# EAGLE design adon3AA (EAGLE 6.5.0)
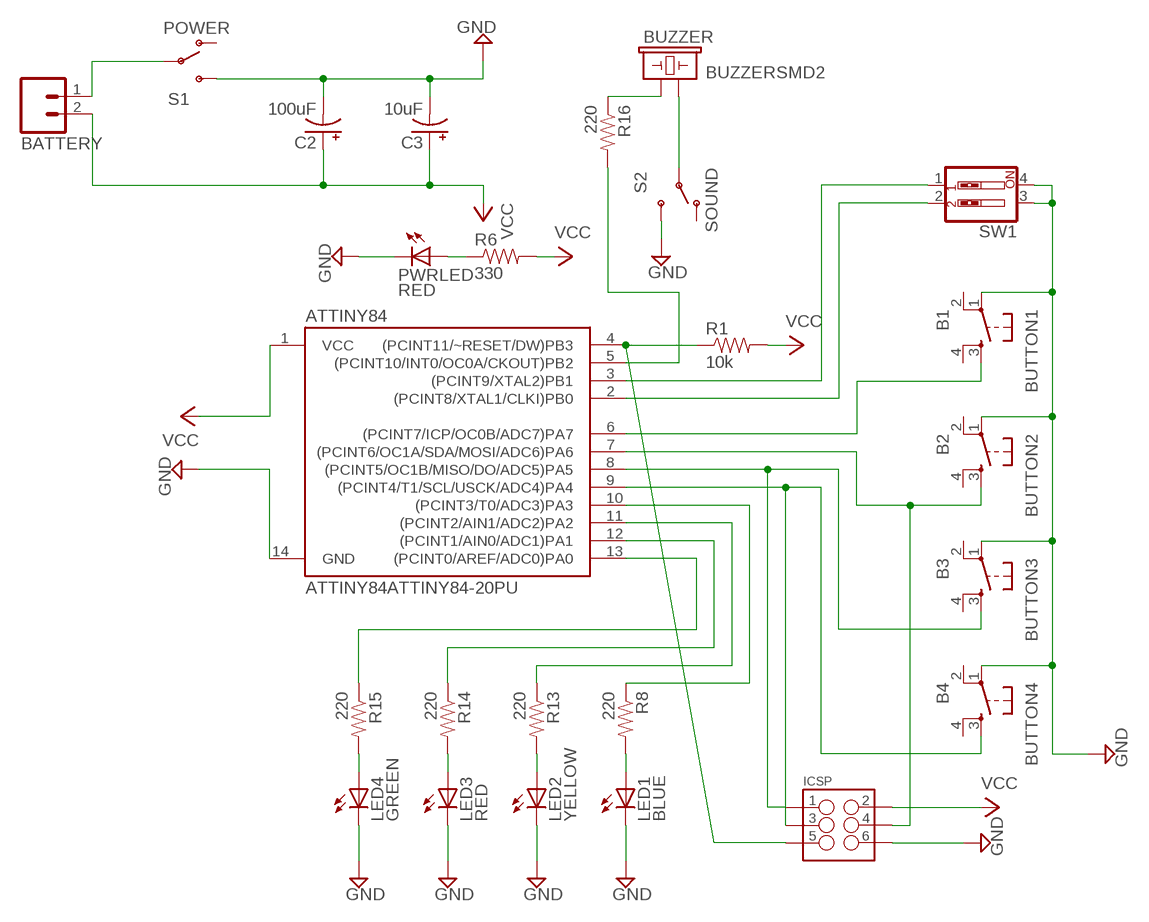
[diagram p0: schematic, sheet 1]

## Parts
ATTINY84  ATTINY84ATTINY84-20PU  [DIL14]
BATTERY  M02JST-PTH-2  [JST-2-PTH]
BUTTON1  B1  TAC_SWITCHPTH  [TACTILE-PTH]
BUTTON2  B2  TAC_SWITCHPTH  [TACTILE-PTH]
BUTTON3  B3  TAC_SWITCHPTH  [TACTILE-PTH]
BUTTON4  B4  TAC_SWITCHPTH  [TACTILE-PTH]
BUZZER  BUZZERSMD2  [BUZZER-CCV]
C2  100uF  CAP_POLPTH1  [CPOL-RADIAL-100UF-25V]
C3  10uF  CAP_POLPTH2  [CPOL-RADIAL-10UF-25V]
ICSP  M03X2NO_SILK  [2X3-NS]
LED1  BLUE  LED5MM  [LED5MM]
LED2  YELLOW  LED5MM  [LED5MM]
LED3  RED  LED5MM  [LED5MM]
LED4  GREEN  LED5MM  [LED5MM]
PWRLED  RED  LED3MM  [LED3MM]
R1  10k  RESISTORPTH-1/4W  [AXIAL-0.4]
R6  330  RESISTORPTH-1/4W  [AXIAL-0.4]
R8  220  RESISTORPTH-1/4W  [AXIAL-0.4]
R13  220  RESISTORPTH-1/4W  [AXIAL-0.4]
R14  220  RESISTORPTH-1/4W  [AXIAL-0.4]
R15  220  RESISTORPTH-1/4W  [AXIAL-0.4]
R16  220  RESISTORPTH-1/4W  [AXIAL-0.4]
S1  POWER  SWITCH-SPDTPTH_LOCK  [SWITCH-SPDT_LOCK.007S]
S2  SOUND  SWITCH-SPDTPTH_LOCK  [SWITCH-SPDT_LOCK.007S]
SW1  SW_DIP-2  [EDG-02]

## Nets
GND: ATTINY84.14(GND) BUTTON1.1 BUTTON2.1 BUTTON3.1 BUTTON4.1 C2.2(-) C3.2(-) ICSP.6 LED1.K(C) LED2.K(C) LED3.K(C) LED4.K(C) PWRLED.K(C) S1.3(S) S2.3(S) SW1.3 SW1.4
N$1: BUZZER.+ R16.P$1
N$2: PWRLED.A R6.P$1
N$3: LED1.A R8.P$2
N$4: LED2.A R13.P$2
N$5: ATTINY84.6((PCINT7/ICP/OC0B/ADC7)PA7) BUTTON1.3
N$6: ATTINY84.5((PCINT10/INT0/OC0A/CKOUT)PB2) R16.P$2
N$7: LED3.A R14.P$2
N$8: LED4.A R15.P$2
N$9: ATTINY84.7((PCINT6/OC1A/SDA/MOSI/ADC6)PA6) BUTTON2.3 ICSP.4
N$10: ATTINY84.3((PCINT9/XTAL2)PB1) SW1.1
N$11: ATTINY84.2((PCINT8/XTAL1/CLKI)PB0) SW1.2
N$12: BATTERY.1 S1.2(P)
N$13: ATTINY84.8((PCINT5/OC1B/MISO/DO/ADC5)PA5) BUTTON3.3 ICSP.1
N$14: ATTINY84.9((PCINT4/T1/SCL/USCK/ADC4)PA4) BUTTON4.3 ICSP.3
N$15: ATTINY84.10((PCINT3/T0/ADC3)PA3) R8.P$1
N$16: ATTINY84.11((PCINT2/AIN1/ADC2)PA2) R13.P$1
N$17: ATTINY84.12((PCINT1/AIN0/ADC1)PA1) R14.P$1
N$18: ATTINY84.13((PCINT0/AREF/ADC0)PA0) R15.P$1
N$21: ATTINY84.4((PCINT11/~RESET/DW)PB3) ICSP.5 R1.P$1
N$23: BUZZER.- S2.2(P)
VCC: ATTINY84.1(VCC) BATTERY.2 C2.1(+) C3.1(+) ICSP.2 R1.P$2 R6.P$2
Unconnected: BUTTON1.2 BUTTON1.4 BUTTON2.2 BUTTON2.4 BUTTON3.2 BUTTON3.4 BUTTON4.2 BUTTON4.4 S1.1(O) S2.1(O)

## Library data of the parts
ATTINY84 = SparkFun-DigitalIC:ATTINY84: Atmel 14-pin 2/4/8kB flash uC
BATTERY = SparkFun-Connectors:M02: Standard 2-pin 0.1" header. Use with - straight break away headers ( PRT-00116) - right angle break away headers (PRT-00553) - swiss pins (PRT-00743) - machine pins (PRT-00117) - female headers (PRT-00115) Molex polarized connector foot print use with: PRT-08233 with associated crimp pins and housings. 2.54_SCREWTERM for use with PRT-10571. 3.5mm Screw Terminal footprints for PRT-08084 5mm Screw Terminal footprints for use with PRT-08433; SKU: PRT-09914
BUTTON1-BUTTON4 = SparkFun-Electromechanical:TAC_SWITCH: Momentary Switch Button commonly used for reset or general input. Spark Fun Electronics SKU : COM-00097 SMT- SWCH-08247
BUZZER = SparkFun-Electromechanical:BUZZER: Buzzer 12mm Spark Fun Electronics SKU : Comp-Buzzer
C2 C3 = SparkFun-Capacitors:CAP_POL: Capacitor Polarized These are standard SMD and PTH capacitors. Normally 10uF, 47uF, and 100uF in electrolytic and tantalum varieties. Always verify the external diameter of the through hole cap, it varies with capacity, voltage, and manufacturer. The EIA devices should be standard.
ICSP = SparkFun-Connectors:M03X2: 2x3 .1" header. Shrouded, with keying- CONN-10681 SMT- CONN-11415 Pogo pins- HW-11044
LED1-LED4 PWRLED = SparkFun-LED:LED: LEDs Standard schematic elements and footprints for 5mm, 3mm, 1206, and 0603 sized LEDs. 5mm - Spark Fun Electronics SKU : COM-00529 (and others)
R1 R6 R8 R13-R16 = SparkFun-Resistors:RESISTOR: Resistor Basic schematic elements and footprints for 0603, 1206, and PTH resistors.
S1 S2 = SparkFun-Electromechanical:SWITCH-SPDT: SPDT Switch Simple slide switch, Spark Fun Electronics SKU : COM-00102 DPDT SMT slide switch, AYZ0202, SWCH-08179
SW1 = special:SW_DIP-2: DIP SWITCH

## Board
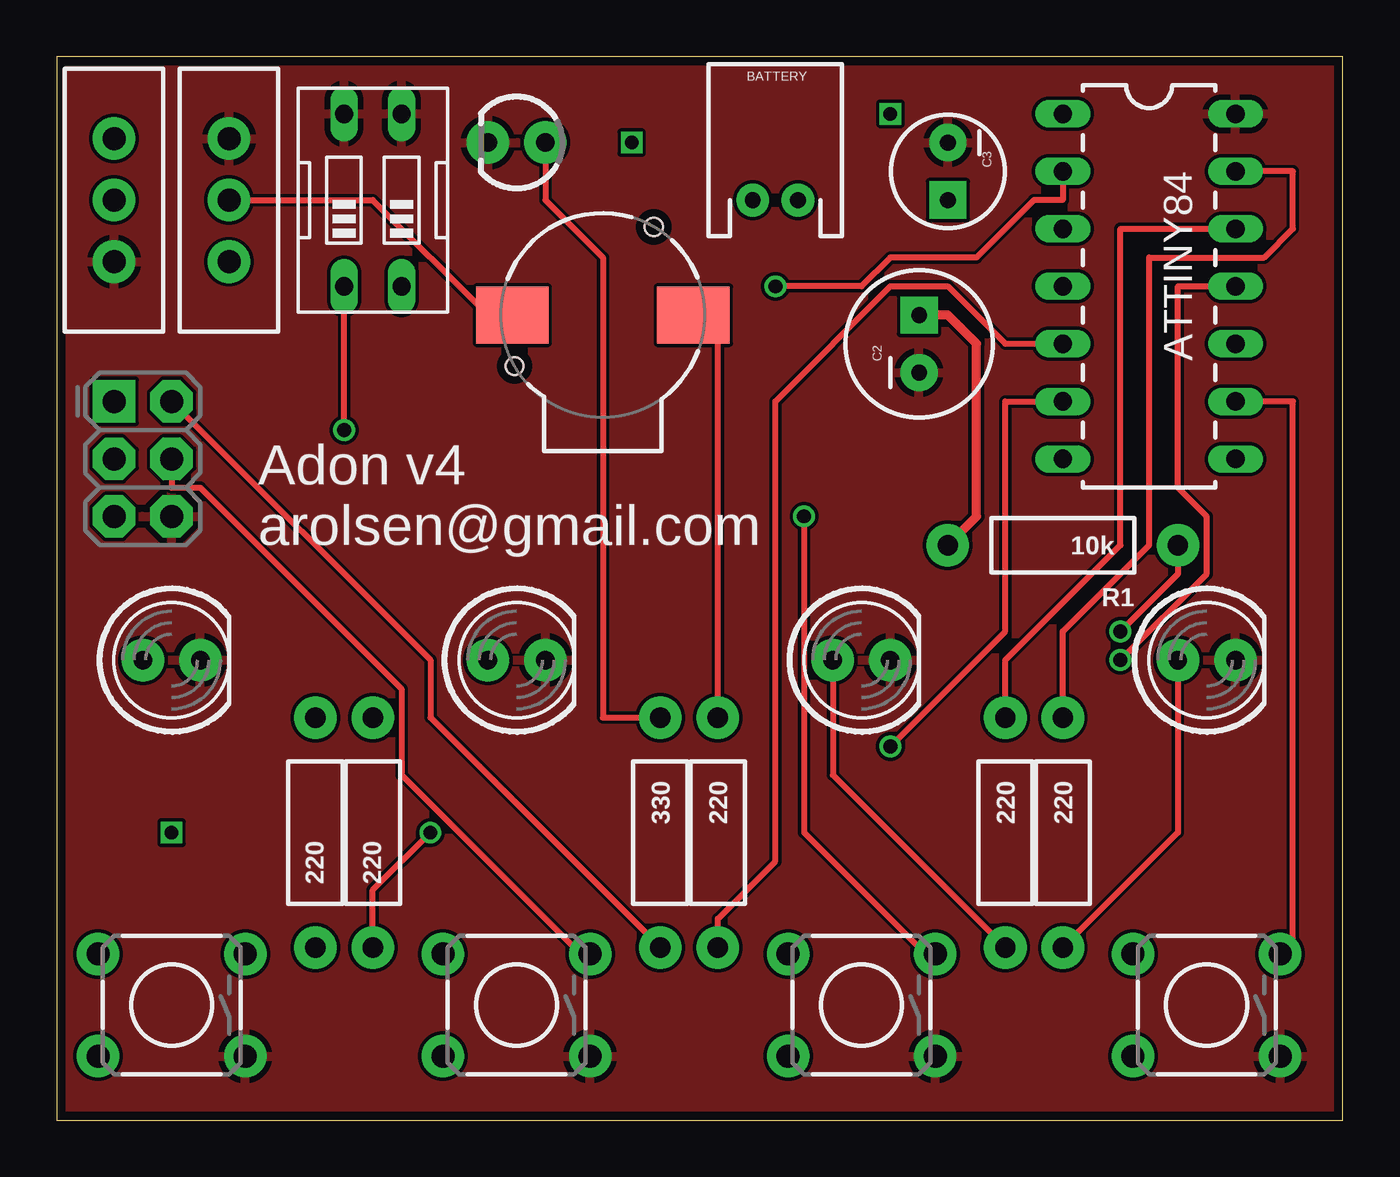
[diagram p1: board, top side]
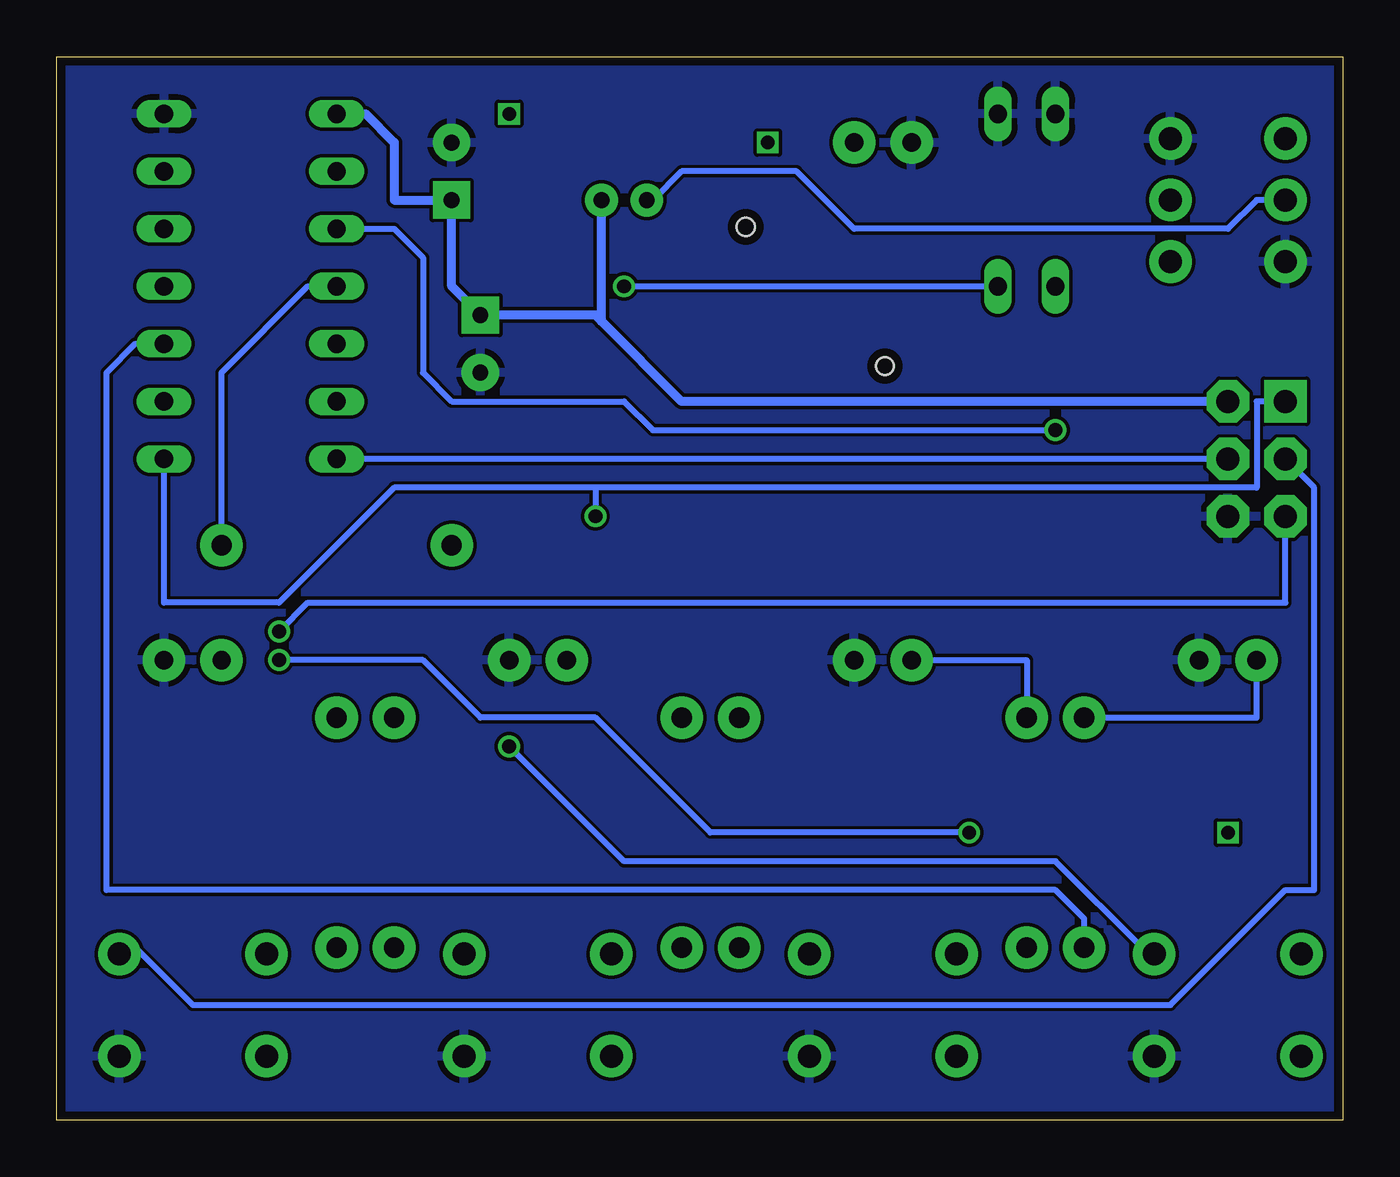
[diagram p2: board, bottom side, seen from below]

Size 56.82 x 46.98 mm. Coordinates in mm from the lower left corner, seen from the top.
Outline: 0,0 56.82,0 56.82,46.98 0,46.98 0,0
Copper layers (1*16): Top 0.0356mm / dielectric 1.5011mm / Bottom 0.0356mm
Design rules "LaenPCBOrder": minimum track width 6mil, minimum drill 13mil, track to track 6mil, track to pad 6mil, pad to pad 6mil, via to via 6mil, smd to smd 6mil, copper to edge 15mil, drill to drill 6mil, minimum pad ring 7mil, minimum via ring 7mil, stop-mask expansion 3mil, vias tented up to drill 0mil, thermal gap 10mil

### Footprints (pad centres in the part's own frame; a part is rotated, then mirrored left to right if it is on the bottom)
DIL14 = drill 0.813 long: 1 -8.89,-3.81; 2 -6.35,-3.81; 3 -3.81,-3.81; 4 -1.27,-3.81; 5 1.27,-3.81; 6 3.81,-3.81; 7 6.35,-3.81; 8 6.35,3.81; 9 3.81,3.81; 10 1.27,3.81; 11 -1.27,3.81; 12 -3.81,3.81; 13 -6.35,3.81; 14 -8.89,3.81
JST-2-PTH = drill 0.7 pad 1.448: 1 -1,0; 2 1,0
TACTILE-PTH = drill 1.016 pad 1.88: 1 -3.251,2.261; 2 3.251,2.261; 3 -3.251,-2.261; 4 3.251,-2.261
BUZZER-CCV = smd 3.2 x 2.5: + 4,0; - -4,0 | hole 0.8: -3.9,-2.25; 2.25,3.9
CPOL-RADIAL-100UF-25V = drill 0.7 pad 1.651 square: 1 1.27,0 | drill 0.7 pad 1.651: 2 -1.27,0
CPOL-RADIAL-10UF-25V = drill 0.7 pad 1.651 square: 1 1.27,0 | drill 0.7 pad 1.651: 2 -1.27,0
2X3-NS = drill 1.016 pad 1.88 square: 1 -2.54,-1.27 | drill 1.016 pad 1.88 octagon: 2 -2.54,1.27; 3 0,-1.27; 4 0,1.27; 5 2.54,-1.27; 6 2.54,1.27
LED5MM = drill 0.813 pad 1.88: A -1.27,0; K 1.27,0
LED3MM = drill 0.813 pad 1.88: A -1.27,0; K 1.27,0
AXIAL-0.4 = drill 0.9 pad 1.88: P$1 -5.08,0; P$2 5.08,0
SWITCH-SPDT_LOCK.007S = drill 1.016 pad 1.88: 1 0,2.718; 2 0,0; 3 0,-2.718
EDG-02 = drill 0.813 long: 1 -1.27,-3.81; 2 1.27,-3.81; 3 1.27,3.81; 4 -1.27,3.81

### Placement (x,y rotation side)
ATTINY84  48.26,35.56 270 top
BATTERY  31.75,40.64 0 top
BUTTON1  5.08,5.08 180 top
BUTTON2  20.32,5.08 180 top
BUTTON3  35.56,5.08 180 top
BUTTON4  50.8,5.08 180 top
BUZZER  24.13,35.56 0 top
C2  38.1,34.29 90 top
C3  39.37,41.91 270 top
ICSP  3.81,29.21 270 top
LED1  5.08,20.32 0 top
LED2  20.32,20.32 0 top
LED3  35.56,20.32 0 top
LED4  50.8,20.32 0 top
PWRLED  20.32,43.18 180 top
R1  44.45,25.4 180 top
R6  26.67,12.7 270 top
R8  11.43,12.7 90 top
R13  13.97,12.7 90 top
R14  41.91,12.7 270 top
R15  44.45,12.7 270 top
R16  29.21,12.7 270 top
S1  2.54,40.64 0 top
S2  7.62,40.64 180 top
SW1  13.97,40.64 0 top

### Tracks (layer width: path | path; a pad name or v marks a point on that pad's centre or on a via)
GND
  pour Bottom: 0,46.99 0,0 57.15,0 57.15,46.99
  pour Top: 0,46.99 0,0 57.15,0 57.15,46.99
N$1
  Top 0.254: R16.P$1 29.21,35.56 BUZZER.+
N$2
  Top 0.254: R6.P$1 24.13,17.78 24.13,38.1 21.59,40.64 PWRLED.A
N$3
  Bottom 0.254: LED1.A 3.81,17.78 R8.P$2
N$4
  Bottom 0.254: R13.P$2 13.97,20.32 LED2.A
N$5  (via drill 0.61)
  Top 0.254: ATTINY84.6 41.91,31.75 41.91,21.59 v36.83,16.51
  Bottom 0.254: v36.83,16.51 31.75,11.43 12.7,11.43 8.89,7.62 BUTTON1.3
N$6
  Top 0.254: ATTINY84.5 41.91,34.29 39.37,36.83 36.83,36.83 31.75,31.75 31.75,11.43 29.21,8.89 R16.P$2
N$7
  Top 0.254: R14.P$2 34.29,15.24 LED3.A
N$8
  Top 0.254: R15.P$2 49.53,12.7 LED4.A
N$9
  Top 0.254: ICSP.4 5.08,27.94 6.35,27.94 15.24,19.05 15.24,15.24 22.86,7.62 BUTTON2.3
  Bottom 0.254: ICSP.4 ATTINY84.7
N$10  (via drill 0.61)
  Top 0.254: v12.7,30.48 SW1.1
  Bottom 0.254: v12.7,30.48 30.48,30.48 31.75,31.75 39.37,31.75 40.64,33.02 40.64,38.1 41.91,39.37 ATTINY84.3
N$11  (via drill 0.61)
  Top 0.254: v31.75,36.83 35.56,36.83 36.83,38.1 40.64,38.1 43.18,40.64 44.45,40.64 ATTINY84.2
  Bottom 0.254: v31.75,36.83 SW1.2
N$12
  Bottom 0.254: S1.2 3.81,40.64 5.08,39.37 21.59,39.37 24.13,41.91 29.21,41.91 30.48,40.64 BATTERY.1
N$13  (via drill 0.61)
  Top 0.254: v33.02,26.67 33.02,12.7 38.1,7.62 BUTTON3.3
  Bottom 0.254: ATTINY84.8 52.07,22.86 46.99,22.86 41.91,27.94 33.02,27.94 | 33.02,27.94 3.81,27.94 3.81,31.75 ICSP.1 | 33.02,27.94 v33.02,26.67
N$14
  Top 0.254: ATTINY84.9 54.61,31.75 54.61,7.62 BUTTON4.3
  Bottom 0.254: ICSP.3 1.27,27.94 1.27,10.16 2.54,10.16 7.62,5.08 50.8,5.08 53.34,7.62 BUTTON4.3
N$15
  Bottom 0.254: ATTINY84.10 53.34,34.29 54.61,33.02 54.61,10.16 12.7,10.16 11.43,8.89 R8.P$1
N$16  (via drill 0.61)
  Top 0.254: ATTINY84.11 49.53,36.83 49.53,27.94 50.8,26.67 50.8,24.13 v46.99,20.32 | v16.51,12.7 13.97,10.16 R13.P$1
  Bottom 0.254: v46.99,20.32 40.64,20.32 38.1,17.78 33.02,17.78 27.94,12.7 v16.51,12.7
N$17
  Top 0.254: ATTINY84.12 46.99,39.37 46.99,25.4 41.91,20.32 R14.P$1
N$18
  Top 0.254: ATTINY84.13 54.61,41.91 54.61,39.37 53.34,38.1 48.26,38.1 48.26,25.4 44.45,21.59 R15.P$1
N$19  (via drill 0.6)
  other vias: 5.08,12.7
N$20  (via drill 0.6)
  other vias: 25.4,43.18
N$21  (via drill 0.61)
  Top 0.254: v46.99,21.59 49.53,24.13 R1.P$1
  Bottom 0.254: ATTINY84.4 45.72,36.83 49.53,33.02 R1.P$1 | ICSP.5 2.54,22.86 45.72,22.86 v46.99,21.59
N$22  (via drill 0.6)
  other vias: 36.83,44.45
N$23
  Top 0.254: S2.2 13.97,40.64 19.05,35.56 BUZZER.-
VCC
  Top 0.254: R6.P$2 16.51,17.78 16.51,20.32 ICSP.2
  Top 0.406: R1.P$2 40.64,26.67 40.64,34.29 39.37,35.56 C2.1
  Bottom 0.406: ICSP.2 29.21,31.75 32.75,35.29 | 32.75,35.29 BATTERY.2 | 32.75,35.29 33.02,35.56 C2.1 39.37,36.83 C3.1 41.91,40.64 41.91,43.18 43.18,44.45 ATTINY84.1

### Text on the board
tPlace: Adon v4 / arolsen@gmail.com